# EAGLE schematic Procesamiento (EAGLE 7.7.0)
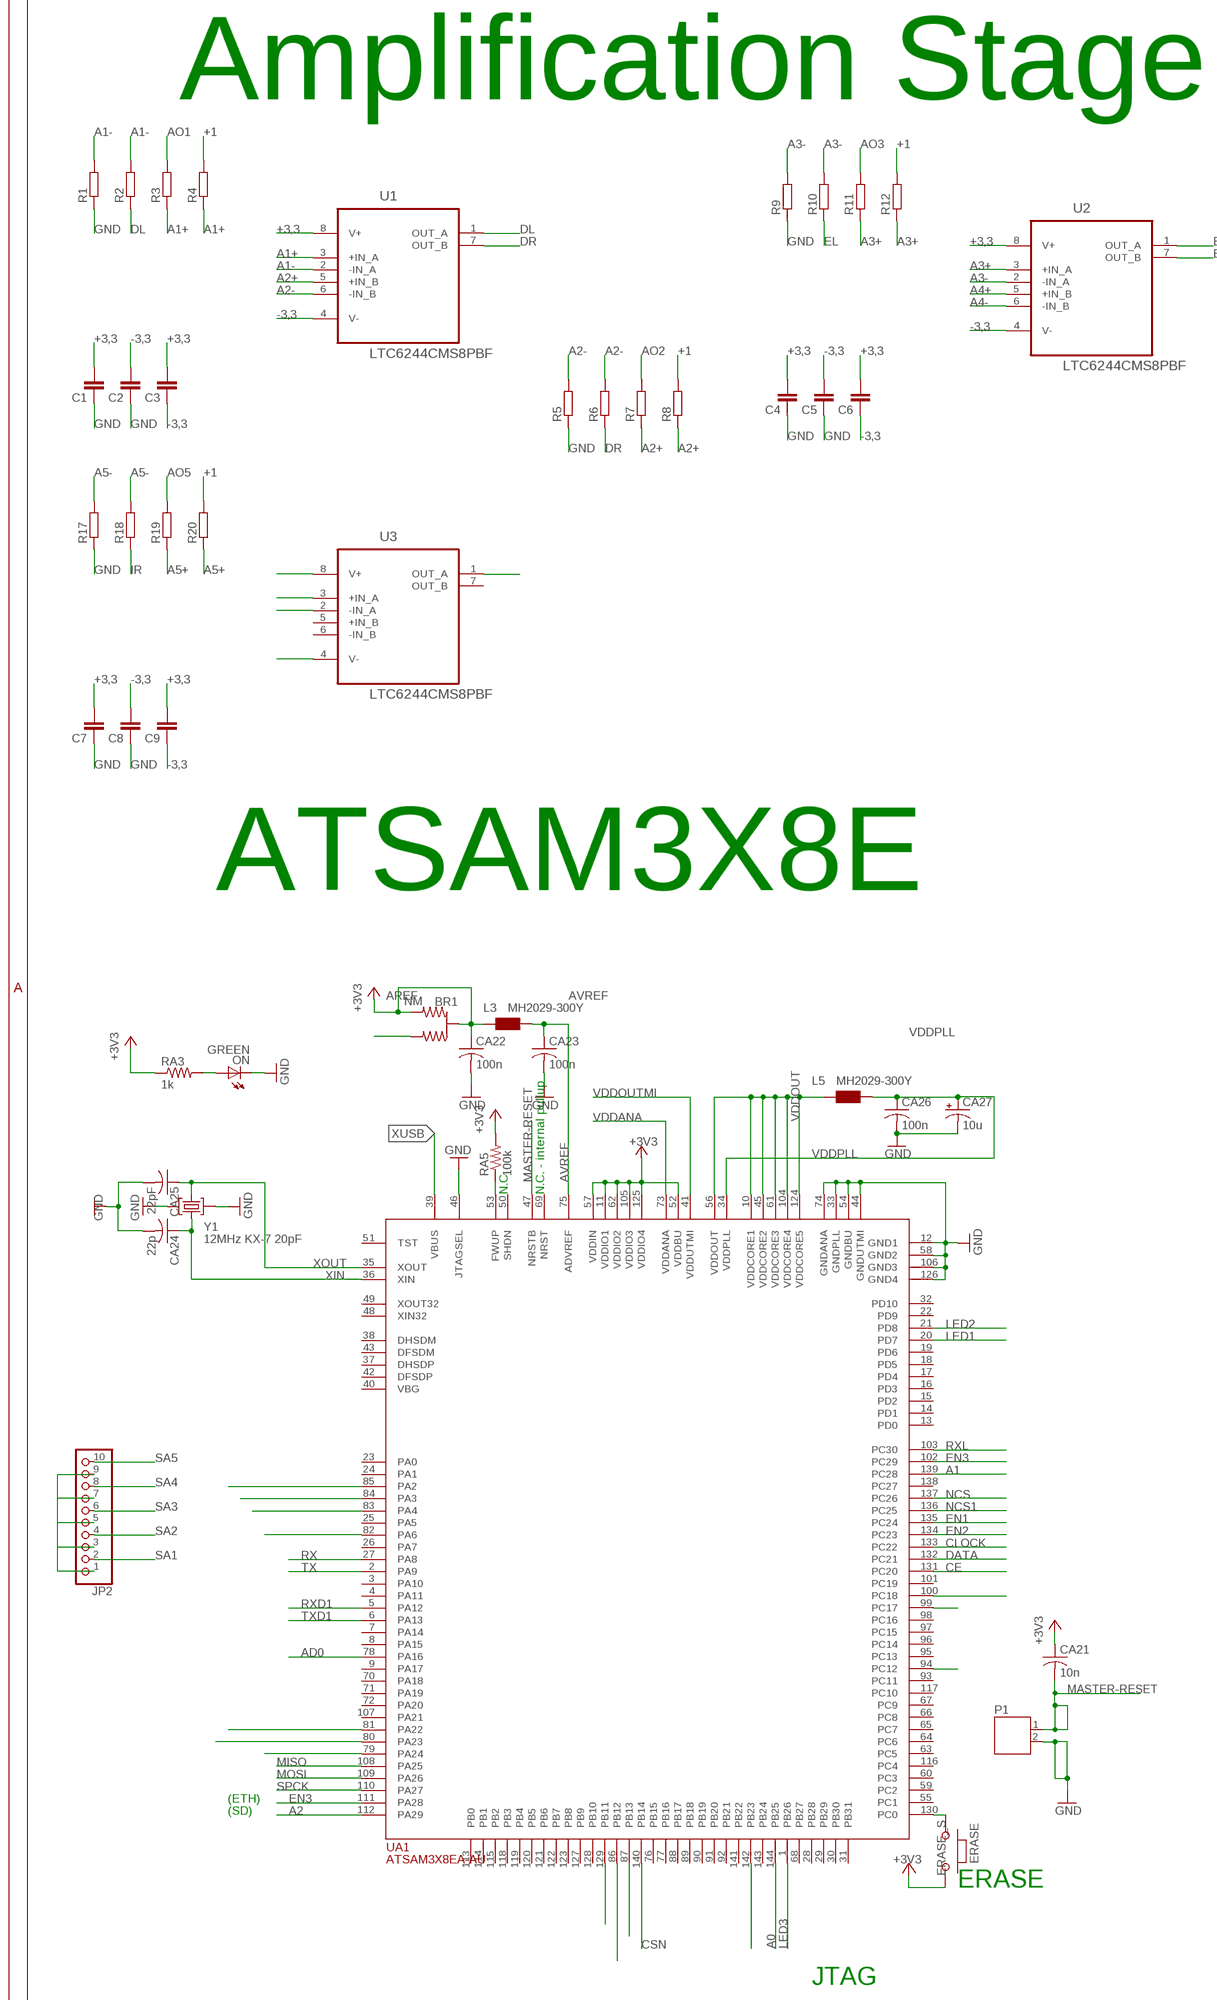
[diagram p0: schematic, sheet 1, part 1 of 2]
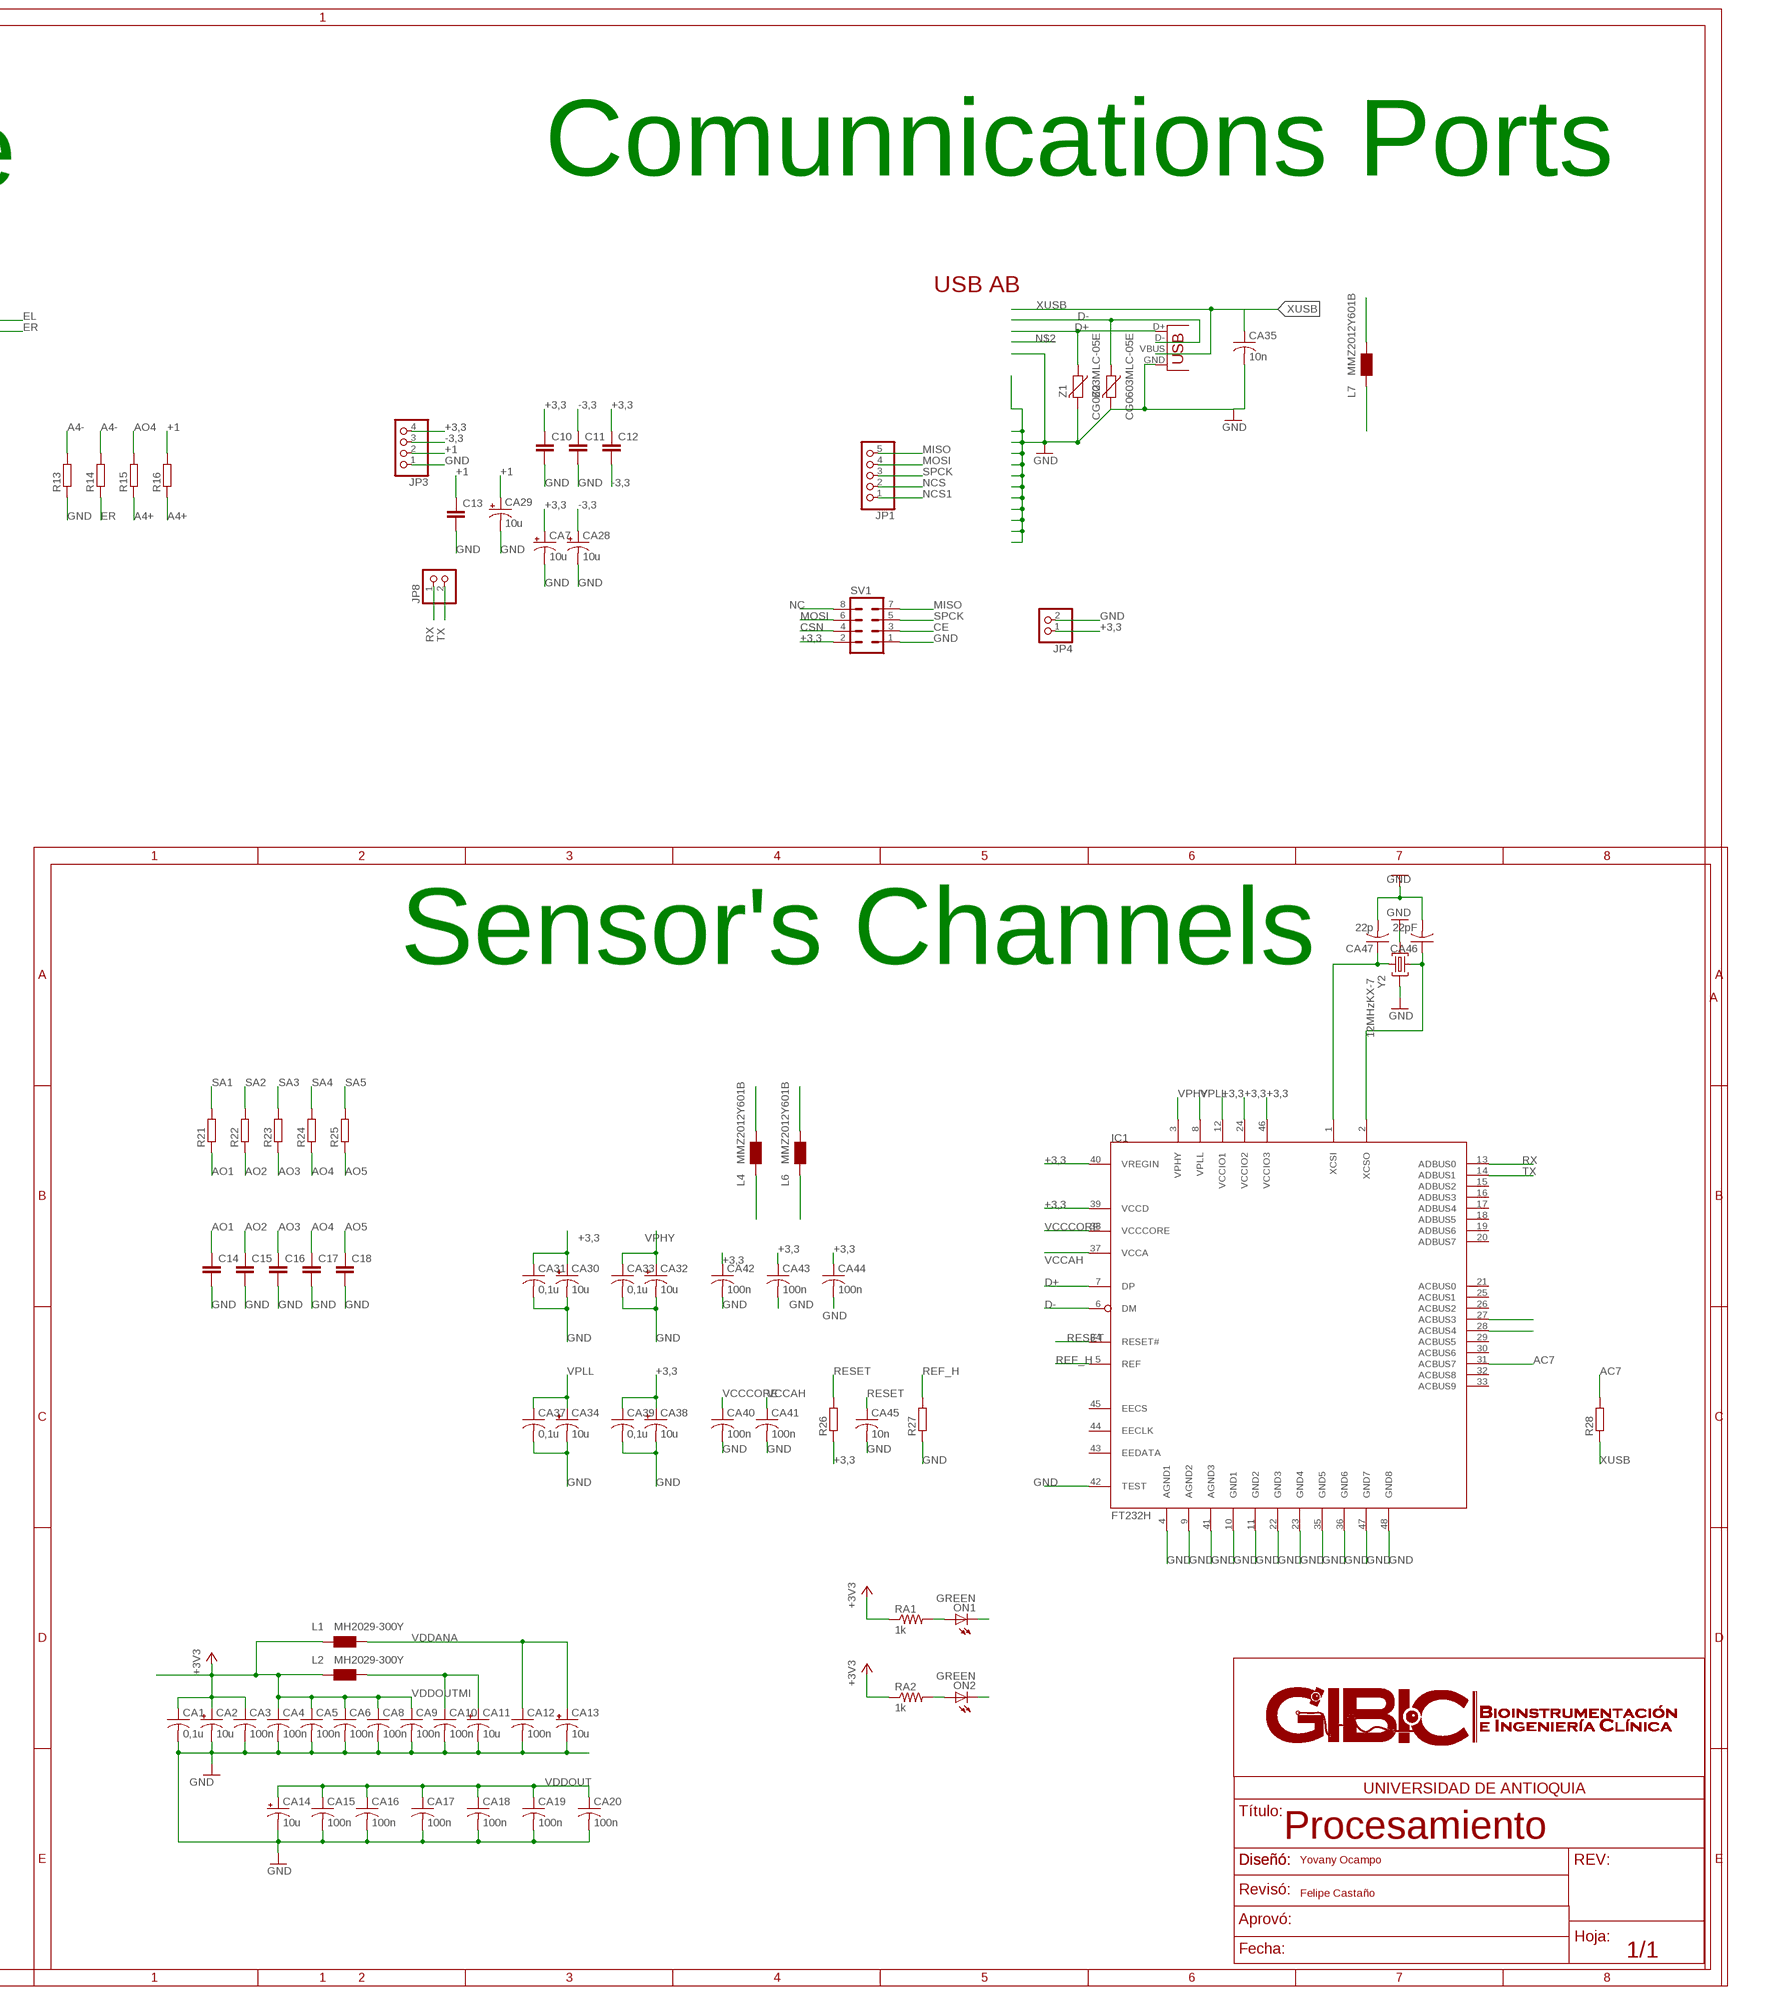
[diagram p1: schematic, sheet 1, part 2 of 2]

## Parts
BR1  NM  J0402  [J0402]
C1  C-EUC0805  [C0805]
C2  C-EUC0805  [C0805]
C3  C-EUC0805  [C0805]
C4  C-EUC0805  [C0805]
C5  C-EUC0805  [C0805]
C6  C-EUC0805  [C0805]
C7  C-EUC0805  [C0805]
C8  C-EUC0805  [C0805]
C9  C-EUC0805  [C0805]
C10  C-EUC0805  [C0805]
C11  C-EUC0805  [C0805]
C12  C-EUC0805  [C0805]
C13  C-EUC0805  [C0805]
C14  C-EUC0805  [C0805]
C15  C-EUC0805  [C0805]
C16  C-EUC0805  [C0805]
C17  C-EUC0805  [C0805]
C18  C-EUC0805  [C0805]
CA1  0,1u  C-USC0805  [C0805]
CA2  10u  CPOL-USB/3528-21W  [B/3528-21W]
CA3  100n  C-USC0805  [C0805]
CA4  100n  C-USC0805  [C0805]
CA5  100n  C-USC0805  [C0805]
CA6  100n  C-USC0805  [C0805]
CA7  10u  CPOL-USB/3528-21W  [B/3528-21W]
CA8  100n  C-USC0805  [C0805]
CA9  100n  C-USC0805  [C0805]
CA10  100n  C-USC0805  [C0805]
CA11  10u  CPOL-USB/3528-21W  [B/3528-21W]
CA12  100n  C-USC0805  [C0805]
CA13  10u  CPOL-USB/3528-21W  [B/3528-21W]
CA14  10u  CPOL-USB/3528-21W  [B/3528-21W]
CA15  100n  C-USC0805  [C0805]
CA16  100n  C-USC0805  [C0805]
CA17  100n  C-USC0805  [C0805]
CA18  100n  C-USC0805  [C0805]
CA19  100n  C-USC0805  [C0805]
CA20  100n  C-USC0805  [C0805]
CA21  10n  C-USC0805  [C0805]
CA22  100n  C-USC0805  [C0805]
CA23  100n  C-USC0805  [C0805]
CA24  22p  C-USC0805  [C0805]
CA25  22pF  C-USC0805  [C0805]
CA26  100n  C-USC0805  [C0805]
CA27  10u  CPOL-USB/3528-21W  [B/3528-21W]
CA28  10u  CPOL-USB/3528-21W  [B/3528-21W]
CA29  10u  CPOL-USB/3528-21W  [B/3528-21W]
CA30  10u  CPOL-USB/3528-21W  [B/3528-21W]
CA31  0,1u  C-USC0805  [C0805]
CA32  10u  CPOL-USB/3528-21W  [B/3528-21W]
CA33  0,1u  C-USC0805  [C0805]
CA34  10u  CPOL-USB/3528-21W  [B/3528-21W]
CA35  10n  C-USC0805  [C0805]
CA37  0,1u  C-USC0805  [C0805]
CA38  10u  CPOL-USB/3528-21W  [B/3528-21W]
CA39  0,1u  C-USC0805  [C0805]
CA40  100n  C-USC0805  [C0805]
CA41  100n  C-USC0805  [C0805]
CA42  100n  C-USC0805  [C0805]
CA43  100n  C-USC0805  [C0805]
CA44  100n  C-USC0805  [C0805]
CA45  10n  C-USC0805  [C0805]
CA46  22pF  C-USC0805  [C0805]
CA47  22p  C-USC0805  [C0805]
ERASE  MYSMD_PB157  [SMD_157SW]
IC1  FT232H  [LQFP48]
JP1  PINHD-1X5  [1X05]
JP2  PINHD-1X10  [1X10]
JP3  PINHD-1X4  [1X04]
JP4  PINHD-1X2  [1X02]
JP8  PINHD-1X2  [1X02]
L1  MH2029-300Y  WE-CBF_0805  [0805]
L2  MH2029-300Y  WE-CBF_0805  [0805]
L3  MH2029-300Y  WE-CBF_0805  [0805]
L4  MMZ2012Y601B  WE-CBF_0805  [0805]
L5  MH2029-300Y  WE-CBF_0805  [0805]
L6  MMZ2012Y601B  WE-CBF_0805  [0805]
L7  MMZ2012Y601B  WE-CBF_0805  [0805]
ON  GREEN  LEDCHIP-LED0805  [CHIP-LED0805]
ON1  GREEN  LEDCHIP-LED0805  [CHIP-LED0805]
ON2  GREEN  LEDCHIP-LED0805  [CHIP-LED0805]
P1  JST-PH2  [JST-PH2]
R1  R-EU_R0805  [R0805]
R2  R-EU_R0805  [R0805]
R3  R-EU_R0805  [R0805]
R4  R-EU_R0805  [R0805]
R5  R-EU_R0805  [R0805]
R6  R-EU_R0805  [R0805]
R7  R-EU_R0805  [R0805]
R8  R-EU_R0805  [R0805]
R9  R-EU_R0805  [R0805]
R10  R-EU_R0805  [R0805]
R11  R-EU_R0805  [R0805]
R12  R-EU_R0805  [R0805]
R13  R-EU_R0805  [R0805]
R14  R-EU_R0805  [R0805]
R15  R-EU_R0805  [R0805]
R16  R-EU_R0805  [R0805]
R17  R-EU_R0805  [R0805]
R18  R-EU_R0805  [R0805]
R19  R-EU_R0805  [R0805]
R20  R-EU_R0805  [R0805]
R21  R-EU_R0805  [R0805]
R22  R-EU_R0805  [R0805]
R23  R-EU_R0805  [R0805]
R24  R-EU_R0805  [R0805]
R25  R-EU_R0805  [R0805]
R26  R-EU_R0805  [R0805]
R27  R-EU_R0805  [R0805]
R28  R-EU_R0805  [R0805]
RA1  1k  R-US_R0805  [R0805]
RA2  1k  R-US_R0805  [R0805]
RA3  1k  R-US_R0805  [R0805]
RA5  100k  R-US_R0805  [R0805]
SV1  MA04-2  [MA04-2]
U1  LTC6244CMS8PBF  [SOP65P490X110-8N]
U2  LTC6244CMS8PBF  [SOP65P490X110-8N]
U3  LTC6244CMS8PBF  [SOP65P490X110-8N]
UA1  ATSAM3X8EA-AU  ATSAM3X/AAU  [LQFP144]
X3  USBPTH  [USB-B-PTH]
Y1  12MHz KX-7 20pF  CRYSTAL-3.2-2.5  [CRYSTAL-3.2-2.5]
Y2  12MHzKX-7  CRYSTAL-3.2-2.5  [CRYSTAL-3.2-2.5]
Z1  CG0603MLC-05E  VARISTORCN0603  [CT/CN0603]
Z2  CG0603MLC-05E  VARISTORCN0603  [CT/CN0603]

## Nets
+1: C13.1 CA29.+ JP3.2 R4.2 R8.2 R12.2 R16.2 R20.2
+3,3: BR1.2(C) BR1.3 C1.2 C3.2 C4.2 C6.2 C7.2 C9.2 C10.1 C12.1 CA1.1 CA2.+ CA3.1 CA4.1 CA5.1 CA6.1 CA7.+ CA8.1 CA9.1 CA21.1 CA22.1 CA30.+ CA31.1 CA38.+ CA39.1 CA42.1 CA43.1 CA44.1 ERASE.1 IC1.12(VCCIO1) IC1.24(VCCIO2) IC1.39(VCCD) IC1.40(VREGIN) IC1.46(VCCIO3) JP3.4 JP4.1 L1.1 L2.1 L3.1 L4.2 L6.2 R26.1 RA1.1 RA2.1 RA3.1 RA5.2 SV1.2 U1.8(V+) U2.8(V+) U3.8(V+) UA1.11(VDDIO1) UA1.52(VDDBU) UA1.57(VDDIN) UA1.62(VDDIO2) UA1.105(VDDIO3) UA1.125(VDDIO4) ; supply symbol labelled +3V3
-3,3: C2.2 C3.1 C5.2 C6.1 C8.2 C9.1 C11.1 C12.2 CA28.+ JP3.3 U1.4(V-) U2.4(V-) U3.4(V-)
A0: UA1.144(PB25)
A1: UA1.139(PC28)
A1+: R3.1 R4.1 U1.3(+IN_A)
A1-: R1.2 R2.2 U1.2(-IN_A)
A2: UA1.112(PA29)
A2+: R7.1 R8.1 U1.5(+IN_B)
A2-: R5.2 R6.2 U1.6(-IN_B)
A3+: R11.1 R12.1 U2.3(+IN_A)
A3-: R9.2 R10.2 U2.2(-IN_A)
A4+: R15.1 R16.1 U2.5(+IN_B)
A4-: R13.2 R14.2 U2.6(-IN_B)
A5+: R19.1 R20.1 U3.3(+IN_A)
A5-: R17.2 R18.2 U3.2(-IN_A)
AC7: IC1.31(ACBUS7) R28.2
AD0: UA1.78(PA16)
AO1: C14.1 R3.2 R21.1
AO2: C15.1 R7.2 R22.1
AO3: C16.1 R11.2 R23.1
AO4: C17.1 R15.2 R24.1
AO5: C18.1 R19.2 R25.1
AREF: BR1.1
AVREF: CA23.1 L3.2 UA1.75(ADVREF)
CE: SV1.3 UA1.131(PC20)
CLOCK: UA1.133(PC22)
CSN: SV1.4 UA1.140(PB14)
D+ [USBpair]: IC1.7(DP) X3.D+ Z1.1
D- [USBpair]: IC1.6(DM) X3.D- Z2.1
DATA: UA1.132(PC21)
DL: R2.1 U1.1(OUT_A) UA1.79(PA24)
DR: R6.1 U1.7(OUT_B) UA1.80(PA23)
EL: R10.1 U2.1(OUT_A) UA1.81(PA22)
EN1: UA1.135(PC24)
EN2: UA1.134(PC23)
EN3: UA1.102(PC29) UA1.111(PA28)
ER: R14.1 U2.7(OUT_B) UA1.82(PA6)
ERASE_S: ERASE.2 UA1.130(PC0)
GND: C1.1 C2.1 C4.1 C5.1 C7.1 C8.1 C10.2 C11.2 C13.2 C14.2 C15.2 C16.2 C17.2 C18.2 CA1.2 CA2.- CA3.2 CA4.2 CA5.2 CA6.2 CA7.- CA8.2 CA9.2 CA10.2 CA11.- CA12.2 CA13.- CA14.- CA15.2 CA16.2 CA17.2 CA18.2 CA19.2 CA20.2 CA22.2 CA23.2 CA24.2 CA25.2 CA26.2 CA27.- CA28.- CA29.- CA30.- CA31.2 CA32.- CA33.2 CA34.- CA35.2 CA37.2 CA38.- CA39.2 CA40.2 CA41.2 CA42.2 CA43.2 CA44.2 CA45.2 CA46.2 CA47.2 IC1.4(AGND1) IC1.9(AGND2) IC1.10(GND1) IC1.11(GND2) IC1.22(GND3) IC1.23(GND4) IC1.35(GND5) IC1.36(GND6) IC1.41(AGND3) IC1.42(TEST) IC1.47(GND7) IC1.48(GND8) JP2.1 JP2.3 JP2.5 JP2.7 JP2.9 JP3.1 JP4.2 L7.1 ON.C P1.2 R1.1 R5.1 R9.1 R13.1 R17.1 R27.1 SV1.1 UA1.12(GND1) UA1.33(GNDPLL) UA1.44(GNDUTMI) UA1.46(JTAGSEL) UA1.54(GNDBU) UA1.58(GND2) UA1.74(GNDANA) UA1.106(GND3) UA1.126(GND4) X3.GND Y1.2(GND) Y1.4(GND) Y2.2(GND) Y2.4(GND) Z1.2 Z2.2
IR: R18.1 U3.1(OUT_A) UA1.83(PA4)
LED1: UA1.20(PD7)
LED2: UA1.21(PD8)
LED3: UA1.1(PB26)
MASTER-RESET: CA21.2 P1.1 UA1.47(NRSTB)
MISO: JP1.5 SV1.7 UA1.108(PA25)
MOSI: JP1.4 SV1.6 UA1.109(PA26)
N$1: UA1.94(PC12)
N$3: ON.A RA3.2
N$4: ON1.A RA1.2
N$5: ON2.A RA2.2
N$7: RA5.1 UA1.53(FWUP)
N$10: UA1.99(PC17)
N$13: UA1.84(PA3)
N$14: UA1.85(PA2)
N$17: UA1.86(PB12)
N$19: UA1.87(PB13)
NC: SV1.8
NCS: JP1.2 UA1.137(PC26)
NCS1: JP1.1 UA1.136(PC25)
PC18: UA1.100(PC18)
REF_H: IC1.5(REF) R27.2
RESET: CA45.1 IC1.34(RESET#) R26.2
RX: IC1.13(ADBUS0) JP8.1 UA1.27(PA8)
RXD1: UA1.5(PA12)
RXL: UA1.103(PC30)
RXLED: IC1.27(ACBUS3) ON1.C
SA1: JP2.2 R21.2
SA2: JP2.4 R22.2
SA3: JP2.6 R23.2
SA4: JP2.8 R24.2
SA5: JP2.10 R25.2
SPCK: JP1.3 SV1.5 UA1.110(PA27)
SS3: UA1.142(PB23)
TX: IC1.14(ADBUS1) JP8.2 UA1.2(PA9)
TXD1: UA1.6(PA13)
TXLED: IC1.28(ACBUS4) ON2.C
UOTGID: UA1.129(PB11)
VCCAH: CA41.1 IC1.37(VCCA)
VCCCORE: CA40.1 IC1.38(VCCCORE)
VDDANA: CA12.1 CA13.+ L1.2 UA1.73(VDDANA)
VDDOUT: CA14.+ CA15.1 CA16.1 CA17.1 CA18.1 CA19.1 CA20.1 L5.1 UA1.10(VDDCORE1) UA1.45(VDDCORE2) UA1.56(VDDOUT) UA1.61(VDDCORE3) UA1.104(VDDCORE4) UA1.124(VDDCORE5)
VDDOUTMI: CA10.1 CA11.+ L2.2 UA1.41(VDDUTMI)
VDDPLL: CA26.1 CA27.+ L5.2 UA1.34(VDDPLL)
VPHY: CA32.+ CA33.1 IC1.3(VPHY) L6.1
VPLL: CA34.+ CA37.1 IC1.8(VPLL) L4.1
XIN: CA24.1 UA1.36(XIN) Y1.1(C1)
XIN1: CA47.1 IC1.1(XCSI) Y2.1(C1)
XOUT: CA25.1 UA1.35(XOUT) Y1.3(C2)
XOUT1: CA46.1 IC1.2(XCSO) Y2.3(C2)
XUSB [usbvcc]: CA35.1 L7.2 R28.1 UA1.39(VBUS) X3.VBUS
Unconnected: IC1.15(ADBUS2) IC1.16(ADBUS3) IC1.17(ADBUS4) IC1.18(ADBUS5) IC1.19(ADBUS6) IC1.20(ADBUS7) IC1.21(ACBUS0) IC1.25(ACBUS1) IC1.26(ACBUS2) IC1.29(ACBUS5) IC1.30(ACBUS6) IC1.32(ACBUS8) IC1.33(ACBUS9) IC1.43(EEDATA) IC1.44(EECLK) IC1.45(EECS) U3.5(+IN_B) U3.6(-IN_B) U3.7(OUT_B) UA1.3(PA10) UA1.4(PA11) UA1.7(PA14) UA1.8(PA15) UA1.9(PA17) UA1.13(PD0) UA1.14(PD1) UA1.15(PD2) UA1.16(PD3) UA1.17(PD4) UA1.18(PD5) UA1.19(PD6) UA1.22(PD9) UA1.23(PA0) UA1.24(PA1) UA1.25(PA5) UA1.26(PA7) UA1.28(PB28) UA1.29(PB29) UA1.30(PB30) UA1.31(PB31) UA1.32(PD10) UA1.37(DHSDP) UA1.38(DHSDM) UA1.40(VBG) UA1.42(DFSDP) UA1.43(DFSDM) UA1.48(XIN32) UA1.49(XOUT32) UA1.50(SHDN) UA1.51(TST) UA1.55(PC1) UA1.59(PC2) UA1.60(PC3) UA1.63(PC5) UA1.64(PC6) UA1.65(PC7) UA1.66(PC8) UA1.67(PC9) UA1.68(PB27) UA1.69(NRST) UA1.70(PA18) UA1.71(PA19) UA1.72(PA20) UA1.76(PB15) UA1.77(PB16) UA1.88(PB17) UA1.89(PB18) UA1.90(PB19) UA1.91(PB20) UA1.92(PB21) UA1.93(PC11) UA1.95(PC13) UA1.96(PC14) UA1.97(PC15) UA1.98(PC16) UA1.101(PC19) UA1.107(PA21) UA1.113(PB0) UA1.114(PB1) UA1.115(PB2) UA1.116(PC4) UA1.117(PC10) UA1.118(PB3) UA1.119(PB4) UA1.120(PB5) UA1.121(PB6) UA1.122(PB7) UA1.123(PB8) UA1.127(PB9) UA1.128(PB10) UA1.138(PC27) UA1.141(PB22) UA1.143(PB24)

## Notes on the sheet
- Amplification Stage | Comunnications Ports
- USB AB
- RX | TX
- ATSAM3X8E
- Sensor's Channels
- N.C. | N.C. - internal pullup
- MISO
- MOSI
- SPCK
- (ETH)
- (SD)
- ERASE
- Yovany Ocampo
- LED3
- Felipe Castaño
- JTAG

## Library data of the parts
BR1 = bibaja:J: Three terminal jumper made from two 0402, 0603, 0805, etc.
C1-C18 = rcl:C-EU: CAPACITOR, European symbol
CA1 CA3-CA6 CA8-CA10 CA12 CA15-CA26 CA31 CA33 CA35 CA37 CA39-CA47 = rcl:C-US: CAPACITOR, American symbol
CA2 CA7 CA11 CA13 CA14 CA27-CA30 CA32 CA34 CA38 = rcl:CPOL-US: POLARIZED CAPACITOR, American symbol
ERASE = SmartPrj:MYSMD_PB157
IC1 = ftdichip-6:FT232H: FTDI FT232H High Speed USB 2.0 Slave Controller
JP1 = pinhead:PINHD-1X5: PIN HEADER
JP2 = pinhead:PINHD-1X10: PIN HEADER
JP3 = pinhead:PINHD-1X4: PIN HEADER
JP4 JP8 = pinhead:PINHD-1X2: PIN HEADER
L1-L7 = wuerth-elektronik:WE-CBF: SMD EMI Suppression Ferrite Beads - excellent anti-EMI properties - low DCR - impedances till 3000 ohms - rated current up to 6 A
ON ON1 ON2 = led:LED: LED OSRAM: - CHIPLED LG R971, LG N971, LY N971, LG Q971, LY Q971, LO R971, LY R971 LH N974, LH R974 LS Q976, LO Q976, LY Q976 LO Q996 - Hyper CHIPLED LW Q18S LB Q993, LB Q99A, LB R99A - SideLED LS A670, LO A670, LY A670, LG A670, LP A670 LB A673, LV A673, LT A673, LW A673 LH A674 LY A675 LS A676, LA A676, LO A676, LY A676, LW A676 LS A679, LY A679, LG A679 - Hyper Micro SIDELED® LS Y876, LA Y876, LO Y876, LY Y876 LT Y87S - SmartLED LW L88C, LW L88S LB L89C, LB L89S, LG L890 LS L89K, LO L89K, LY L89K LS L896, LA L896, LO L896, LY L896 - TOPLED LS T670, LO T670, LY T670, LG T670, LP T670 LSG T670, LSP T670, LSY T670, LOP T670, LYG T670 LG T671, LOG T671, LSG T671 LB T673, LV T673, LT T673, LW T673 LH T674 LS T676, LA T676, LO T676, LY T676, LB T676, LH T676, LSB T676, LW T676 LB T67C, LV T67C, LT T67C, LS T67K, LO T67K, LY T67K, LW E67C LS E67B, LA E67B, LO E67B, LY E67B, LB E67C, LV E67C, LT E67C LW T67C LS T679, LY T679, LG T679 LS T770, LO T770, LY T770, LG T770, LP T770 LB T773, LV T773, LT T773, LW T773 LH T774 LS E675, LA E675, LY E675, LS T675 LS T776, LA T776, LO T776, LY T776, LB T776 LHGB T686 LT T68C, LB T68C - Hyper Mini TOPLED® LB M676 - Mini TOPLED Santana® LG M470 LS M47K, LO M47K, LY M47K Source: http://www.osram.convergy.de LUXEON: - LUMILED® LXK2-PW12-R00, LXK2-PW12-S00, LXK2-PW14-U00, LXK2-PW14-V00 LXK2-PM12-R00, LXK2-PM12-S00, LXK2-PM14-U00 LXK2-PE12-Q00, LXK2-PE12-R00, LXK2-PE12-S00, LXK2-PE14-T00, LXK2-PE14-U00 LXK2-PB12-K00, LXK2-PB12-L00, LXK2-PB12-M00, LXK2-PB14-N00, LXK2-PB14-P00, LXK2-PB14-Q00 LXK2-PR12-L00, LXK2-PR12-M00, LXK2-PR14-Q00, LXK2-PR14-R00 LXK2-PD12-Q00, LXK2-PD12-R00, LXK2-PD12-S00 LXK2-PH12-R00, LXK2-PH12-S00 LXK2-PL12-P00, LXK2-PL12-Q00, LXK2-PL12-R00 Source: www.luxeon.com KINGBRIGHT: KA-3528ASYC Source: www.kingbright.com
P1 = jst-ph:JST-PH2
R1-R28 = rcl:R-EU_: RESISTOR, European symbol
RA1-RA3 RA5 = rcl:R-US_: RESISTOR, American symbol
SV1 = con-lstb:MA04-2: PIN HEADER; OC_FARNELL: unknown; OC_NEWARK: unknown
U1-U3 = LTC6244CMS8PBF:LTC6244CMS8PBF: Dual 50MHz, Low Noise,Rail-to-Rail, CMOS Op Amp; AVAILABILITY: Good; DESCRIPTION: LTC6244 - Dual 50MHz, Low Noise, Rail-to-Rail, CMOS Op Amp; MF: Linear Technology; MP: LTC6244CMS8#PBF; PACKAGE: MSOP-8 Linear Technology; PRICE: 2.34 USD
UA1 = SmartPrj:ATSAM3X/A
X3 = usb:USB: USB Connectors USB-B-PTH is fully proven SKU : PRT-00139 USB-miniB is fully proven SKU : PRT-00587 USB-A-PCB is untested. USB-A-H is throughly reviewed, but untested. Spark Fun Electronics SKU : PRT-00437 USB-B-SMT is throughly reviewed, but untested. Needs silkscreen touching up. USB-A-S has not been used/tested USB-MB-H has not been used/tested
Y1 Y2 = SmartPrj:CRYSTAL-3.2-2.5
Z1 Z2 = varistor:VARISTOR: VARISTOR

## Net classes
1 USB: width 0.203 mm, drill 0.254 mm, clearance 0.203 mm
2 gnd1: width 0.203 mm, drill 0.254 mm, clearance 0.203 mm
3 usbvcc: width 0.203 mm, drill 0.254 mm, clearance 0.203 mm
4 USBpair: width 0.203 mm, drill 0.254 mm, clearance 0.203 mm
5 UA1: width 0.127 mm, drill 0.254 mm, clearance 0.127 mm